# Altium project Teknofest_2022.PrjPcb
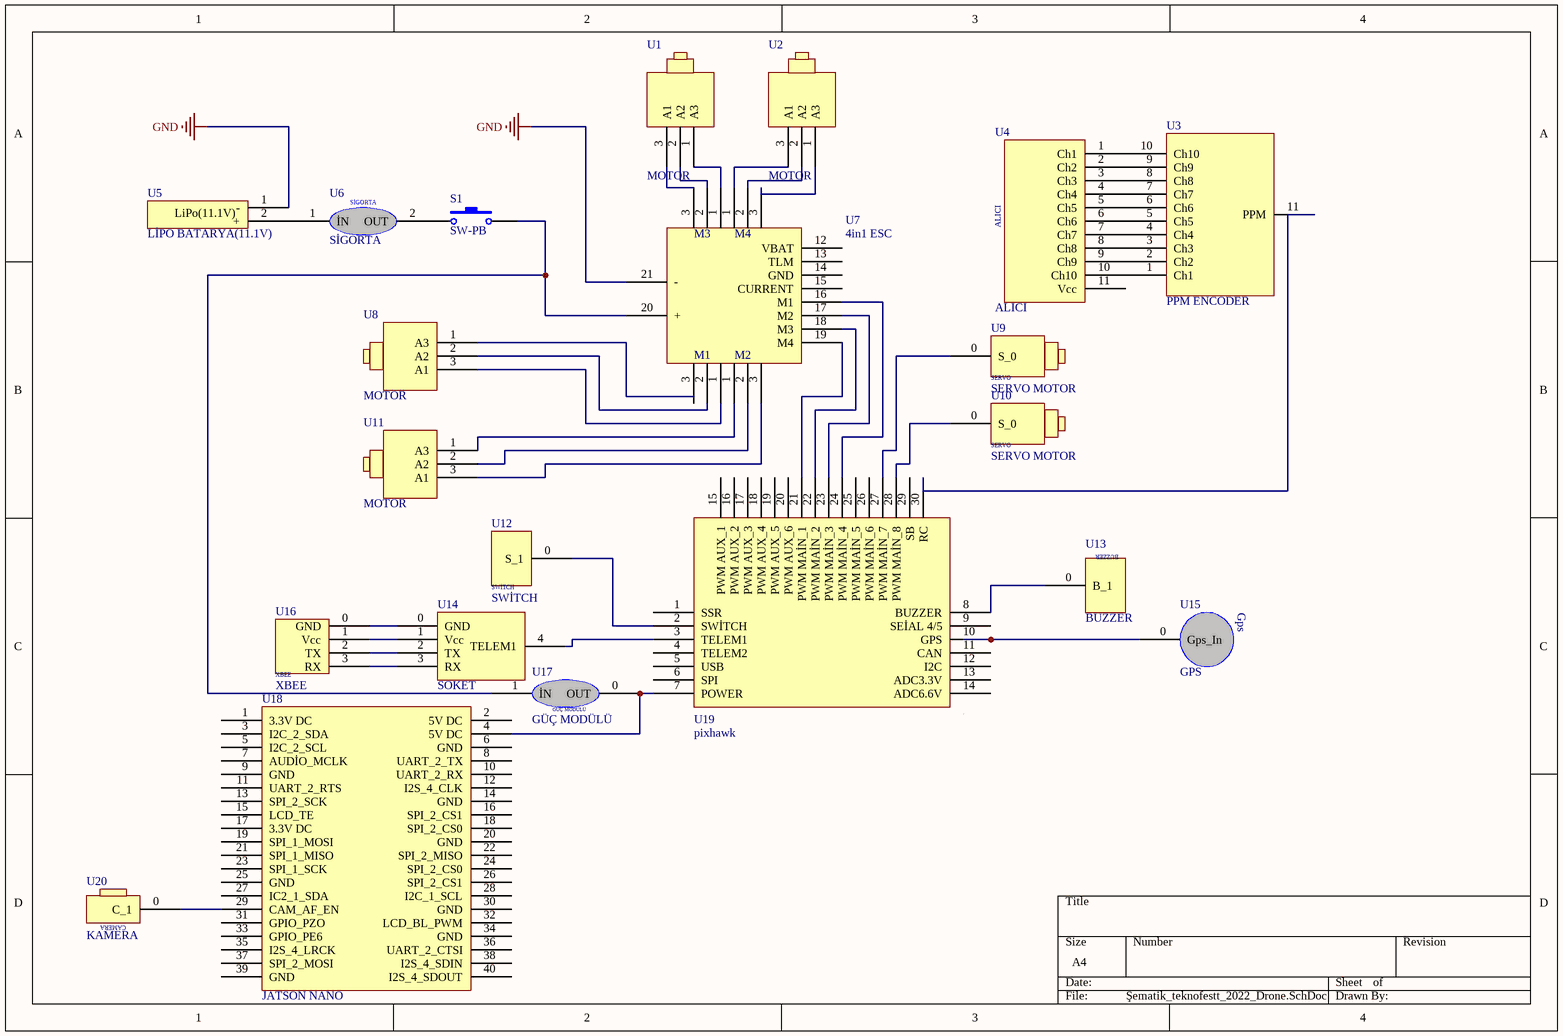
[diagram p0: Şematik_teknofestt_2022_Drone.SchDoc]
3 sheets, 43 parts. Net scope: flat (ports and power ports of the same name join across sheets).
Sheets:
  Şematik_teknofestt_2022_Drone.SchDoc
  Sheet1.SchDoc
  Sheet2.SchDoc

## Sheet Şematik_teknofestt_2022_Drone.SchDoc
size A4; SheetNumber: 1; SheetTotal: 2

### Parts
S1  SW-PB  [SPST-2]
U1  MOTOR
U2  MOTOR
U3  PPM ENCODER
U4  ALICI
U5  LİPO BATARYA(11.1V)
U6  SİGORTA
U7  4in1 ESC
U8  MOTOR
U9  SERVO MOTOR
U10  SERVO MOTOR
U11  MOTOR
U12  SWİTCH
U13  BUZZER
U14  SOKET
U15  GPS
U16  XBEE
U17  GÜÇ MODÜLÜ
U18  JATSON NANO
U19  pixhawk
U20  KAMERA

### Nets
GND: U5.1(-) U7.21(-)
NetS1_2: S1.2 U7.20(+) U17.1(İN)
NetU1_1: U1.1(A3) U7.1
NetU1_2: U1.2(A2) U7.2
NetU1_3: U1.3(A1) U7.3
NetU2_1: U2.1(A3) U7.3
NetU2_2: U2.2(A2) U7.2
NetU2_3: U2.3(A1) U7.1
NetU3_1: U3.1(Ch1) U4.10(Ch10)
NetU3_2: U3.2(Ch2) U4.9(Ch9)
NetU3_3: U3.3(Ch3) U4.8(Ch8)
NetU3_4: U3.4(Ch4) U4.7(Ch7)
NetU3_5: U3.5(Ch5) U4.6(Ch6)
NetU3_6: U3.6(Ch6) U4.5(Ch5)
NetU3_7: U3.7(Ch7) U4.4(Ch4)
NetU3_8: U3.8(Ch8) U4.3(Ch3)
NetU3_9: U3.9(Ch9) U4.2(Ch2)
NetU3_10: U3.10(Ch10) U4.1(Ch1)
NetU3_11: U3.11(PPM) U19.30(RC)
NetU5_2: U5.2(+) U6.1(İN)
NetU7_1: U7.1 U8.3(A1)
NetU7_1: U7.1 U11.1(A3)  [a separate net that carries the same name]
NetU7_2: U7.2 U8.2(A2)
NetU7_2: U7.2 U11.2(A2)  [a separate net that carries the same name]
NetU7_3: U7.3 U11.3(A1)
NetU7_16: U7.16(M1) U19.24(PWM_MAİN_4)
NetU7_17: U7.17(M2) U19.23(PWM_MAİN_3)
NetU7_18: U7.18(M3) U19.22(PWM_MAİN_2)
NetU7_19: U7.19(M4) U19.21(PWM_MAİN_1)
NetU9_0: U9.0(S_0) U19.27(PWM_MAİN_7)
NetU10_0: U10.0(S_0) U19.28(PWM_MAİN_8)
NetU12_0: U12.0(S_1) U19.2(SWİTCH)
NetU13_0: U13.0(B_1) U19.8(BUZZER)
NetU14_0: U14.0(GND) U16.0(GND)
NetU14_1: U14.1(Vcc) U16.1(Vcc)
NetU14_2: U14.2(TX) U16.2(TX)
NetU14_3: U14.3(RX) U16.3(RX)
NetU14_4: U14.4(TELEM1) U19.3(TELEM1)
NetU15_0: U15.0(Gps_In) U19.10(GPS)
NetU17_0: U17.0(OUT) U18.4(5V_DC) U19.7(POWER)
NetU18_29: U18.29(CAM_AF_EN) U20.0(C_1)

Not connected (* = marked no-connect by the designer): S1 1; U4 11(Vcc); U6 2(OUT); U7 12(VBAT) 13(TLM) 14(GND) 15(CURRENT); U8 1(A3); U18 1(3.3V_DC) 2(5V_DC) 3(I2C_2_SDA) 5(I2C_2_SCL) 6(GND) 7(AUDİO_MCLK) 8(UART_2_TX) 9(GND) 10(UART_2_RX) 11(UART_2_RTS) 12(I2S_4_CLK) 13(SPI_2_SCK) 14(GND) 15(LCD_TE) 16(SPI_2_CS1) 17(3.3V_DC) 18(SPI_2_CS0) 19(SPI_1_MOSI) 20(GND) 21(SPI_1_MISO) 22(SPI_2_MISO) 23(SPI_1_SCK) 24(SPI_2_CS0) 25(GND) 26(SPI_2_CS1) 27(IC2_1_SDA) 28(I2C_1_SCL) 30(GND) 31(GPIO_PZO) 32(LCD_BL_PWM) 33(GPIO_PE6) 34(GND) 35(I2S_4_LRCK) 36(UART_2_CTSI) 37(SPI_2_MOSI) 38(I2S_4_SDIN) 39(GND) 40(I2S_4_SDOUT); U19 1(SSR) 4(TELEM2) 5(USB) 6(SPI) 9(SEİAL_4/5) 11(CAN) 12(I2C) 13(ADC3.3V) 14(ADC6.6V) 15(PWM_AUX_1) 16(PWM_AUX_2) 17(PWM_AUX_3) 18(PWM_AUX_4) 19(PWM_AUX_5) 20(PWM_AUX_6) 25(PWM_MAİN_5) 26(PWM_MAİN_6) 29(SB)

### Notes on the sheet
- (in symbol GPS) Gps
- (in symbol KAMERA) CAMERA
- (in symbol LİPO BATARYA(11.1V)) LiPo(11.1V)
- (in symbol SERVO MOTOR) SERVO

### Library data of the parts
S1 = SW-PB: Switch; Published: 24-Mar-1999; LatestRevisionDate: 17-Jul-2002; LatestRevisionNote: Re-released for DXP Platform.; PackageReference: SPST-2; Publisher: Altium Limited; PackageDescription: Switch; 2 Leads

## Sheet Sheet1.SchDoc
size A4; SheetNumber: 2; SheetTotal: 2
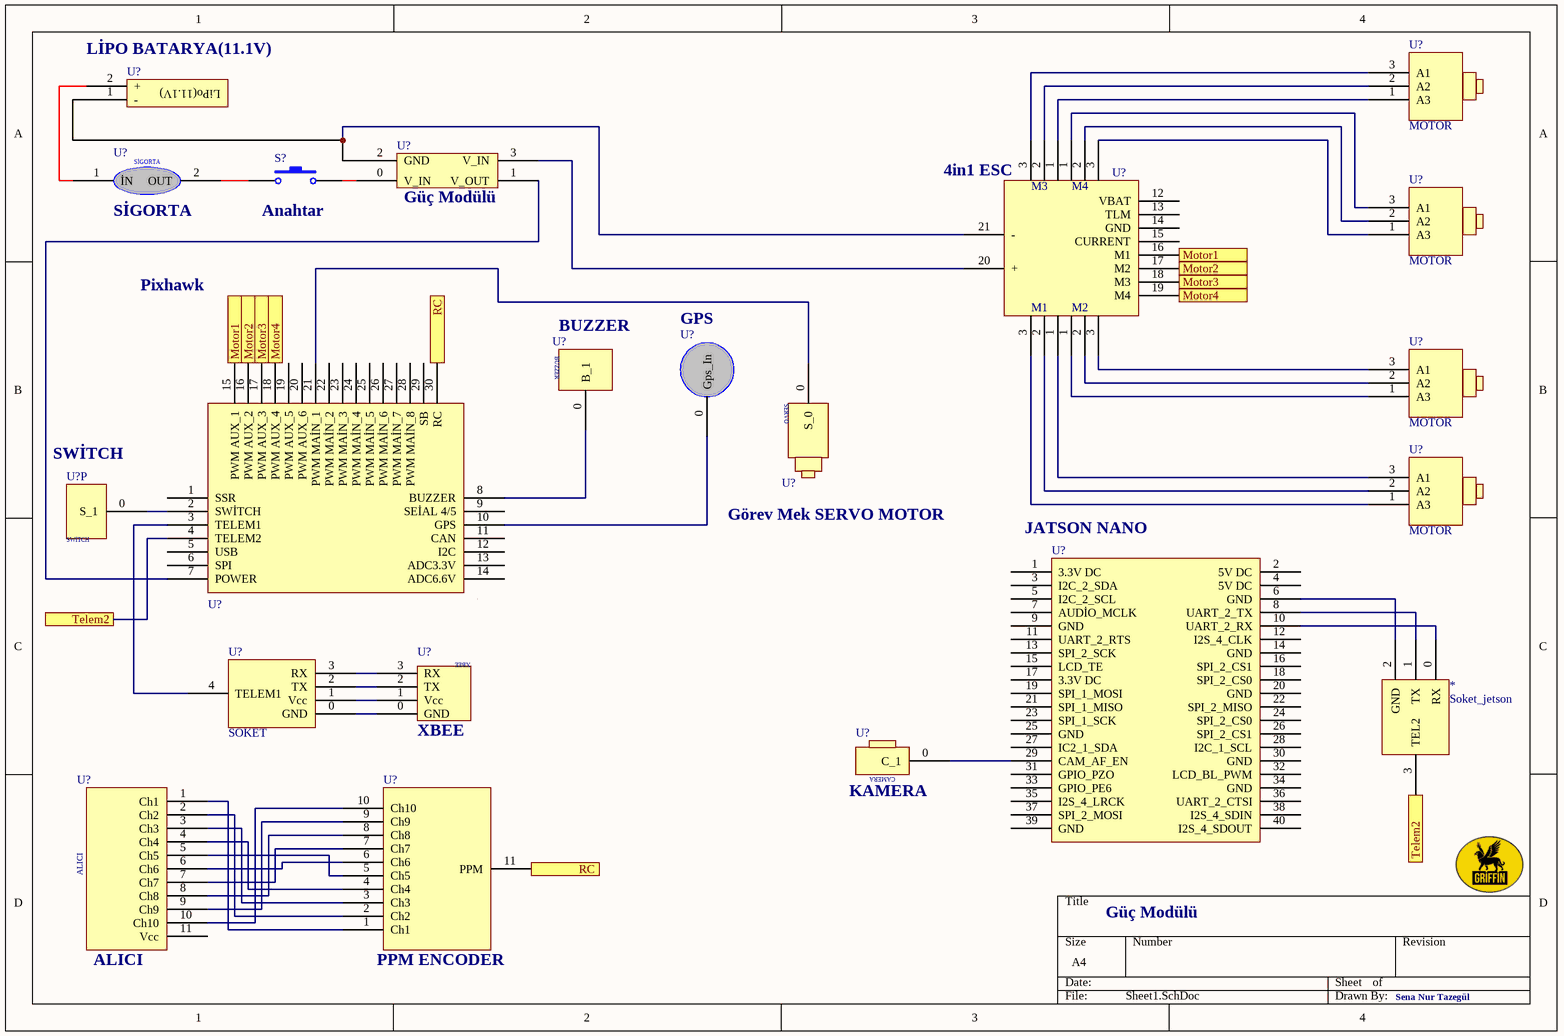
[diagram p1: Sheet1.SchDoc]

### Parts
(Parts that share a designator on the sheet are numbered #1, #2 ... from top to bottom, then left to right.)
*  Soket_jetson
S?  Anahtar  [SPST-2]
U?#1  Pixhawk
U?#2  LİPO BATARYA(11.1V)
U?#3  MOTOR
U?#4  (no value)
U?#5  SİGORTA
U?#6  4in1 ESC
U?#7  MOTOR
U?#8  BUZZER
U?#9  MOTOR
U?#10  GPS
U?#11  Görev Mek SERVO MOTOR
U?#12  MOTOR
U?#13  SOKET
U?#14  XBEE
U?#15  KAMERA
U?#16  ALICI
U?#17  JATSON NANO
U?#18  PPM ENCODER
U?P  SWİTCH

### Ports
Motor1, Motor2, Motor3, Motor4, RC, Telem2

### Nets
Net*_0: *.0(RX) U?#17.10(UART_2_RX)
Net*_1: *.1(TX) U?#17.8(UART_2_TX)
Net*_2: *.2(GND) U?#17.6(GND)
Net*_3: *.3(TEL2) U?#1.4(TELEM2) ; port Telem2
NetS?_1: S?.1 U?#5.2(OUT)
NetS?_2: S?.2 U?#4.0(V_IN)
NetU?#1_2: U?#1.2(SWİTCH) U?P.0(S_1)
NetU?#1_3: U?#1.3(TELEM1) U?#13.4(TELEM1)
NetU?#1_7: U?#1.7(POWER) U?#4.1(V_OUT)
NetU?#1_8: U?#1.8(BUZZER) U?#8.0(B_1)
NetU?#1_10: U?#1.10(GPS) U?#10.0(Gps_In)
NetU?#1_15: U?#1.15(PWM_AUX_1) U?#6.16(M1) ; port Motor1
NetU?#1_16: U?#1.16(PWM_AUX_2) U?#6.17(M2) ; port Motor2
NetU?#1_17: U?#1.17(PWM_AUX_3) U?#6.18(M3) ; port Motor3
NetU?#1_18: U?#1.18(PWM_AUX_4) U?#6.19(M4) ; port Motor4
NetU?#1_21: U?#1.21(PWM_MAİN_1) U?#11.0(S_0)
NetU?#1_30: U?#1.30(RC) U?#18.11(PPM) ; port RC
NetU?#2_1: U?#2.1(-) U?#4.2(GND) U?#6.21(-)
NetU?#2_2: U?#2.2(+) U?#5.1(İN)
NetU?#3_1: U?#3.1(A3) U?#6.1
NetU?#3_2: U?#3.2(A2) U?#6.2
NetU?#3_3: U?#3.3(A1) U?#6.3
NetU?#4_3: U?#4.3(V_IN) U?#6.20(+)
NetU?#6_1: U?#6.1 U?#9.1(A3)
NetU?#6_1: U?#6.1 U?#12.3(A1)  [a separate net that carries the same name]
NetU?#6_1: U?#6.1 U?#7.3(A1)  [a separate net that carries the same name]
NetU?#6_2: U?#6.2 U?#9.2(A2)
NetU?#6_2: U?#6.2 U?#12.2(A2)  [a separate net that carries the same name]
NetU?#6_2: U?#6.2 U?#7.2(A2)  [a separate net that carries the same name]
NetU?#6_3: U?#6.3 U?#9.3(A1)
NetU?#6_3: U?#6.3 U?#12.1(A3)  [a separate net that carries the same name]
NetU?#6_3: U?#6.3 U?#7.1(A3)  [a separate net that carries the same name]
NetU?#13_0: U?#13.0(GND) U?#14.0(GND)
NetU?#13_1: U?#13.1(Vcc) U?#14.1(Vcc)
NetU?#13_2: U?#13.2(TX) U?#14.2(TX)
NetU?#13_3: U?#13.3(RX) U?#14.3(RX)
NetU?#15_0: U?#15.0(C_1) U?#17.29(CAM_AF_EN)
NetU?#16_1: U?#16.1(Ch1) U?#18.1(Ch1)
NetU?#16_2: U?#16.2(Ch2) U?#18.2(Ch2)
NetU?#16_3: U?#16.3(Ch3) U?#18.3(Ch3)
NetU?#16_4: U?#16.4(Ch4) U?#18.4(Ch4)
NetU?#16_5: U?#16.5(Ch5) U?#18.5(Ch5)
NetU?#16_6: U?#16.6(Ch6) U?#18.6(Ch6)
NetU?#16_7: U?#16.7(Ch7) U?#18.7(Ch7)
NetU?#16_8: U?#16.8(Ch8) U?#18.8(Ch8)
NetU?#16_9: U?#16.9(Ch9) U?#18.9(Ch9)
NetU?#16_10: U?#16.10(Ch10) U?#18.10(Ch10)

Not connected (* = marked no-connect by the designer): U?#1 1(SSR) 5(USB) 6(SPI) 9(SEİAL_4/5) 11(CAN) 12(I2C) 13(ADC3.3V) 14(ADC6.6V) 19(PWM_AUX_5) 20(PWM_AUX_6) 22(PWM_MAİN_2) 23(PWM_MAİN_3) 24(PWM_MAİN_4) 25(PWM_MAİN_5) 26(PWM_MAİN_6) 27(PWM_MAİN_7) 28(PWM_MAİN_8) 29(SB); U?#6 12(VBAT) 13(TLM) 14(GND) 15(CURRENT); U?#16 11(Vcc); U?#17 1(3.3V_DC) 2(5V_DC) 3(I2C_2_SDA) 4(5V_DC) 5(I2C_2_SCL) 7(AUDİO_MCLK) 9(GND) 11(UART_2_RTS) 12(I2S_4_CLK) 13(SPI_2_SCK) 14(GND) 15(LCD_TE) 16(SPI_2_CS1) 17(3.3V_DC) 18(SPI_2_CS0) 19(SPI_1_MOSI) 20(GND) 21(SPI_1_MISO) 22(SPI_2_MISO) 23(SPI_1_SCK) 24(SPI_2_CS0) 25(GND) 26(SPI_2_CS1) 27(IC2_1_SDA) 28(I2C_1_SCL) 30(GND) 31(GPIO_PZO) 32(LCD_BL_PWM) 33(GPIO_PE6) 34(GND) 35(I2S_4_LRCK) 36(UART_2_CTSI) 37(SPI_2_MOSI) 38(I2S_4_SDIN) 39(GND) 40(I2S_4_SDOUT)

### Notes on the sheet
- Güç Modülü
- Sena Nur Tazegül
- (in symbol GÜÇ MODÜLÜ) Güç Modülü
- (in symbol KAMERA) CAMERA
- (in symbol LİPO BATARYA(11.1V)) LiPo(11.1V)
- (in symbol SERVO MOTOR) SERVO

### Library data of the parts
S? = SW-PB: Switch; Published: 24-Mar-1999; LatestRevisionDate: 17-Jul-2002; LatestRevisionNote: Re-released for DXP Platform.; PackageReference: SPST-2; Publisher: Altium Limited; PackageDescription: Switch; 2 Leads
U?#4 = GÜÇ MODÜLÜ
U?#11 = SERVO MOTOR

## Sheet Sheet2.SchDoc
size A4; SheetNumber: 3; SheetTotal: 3
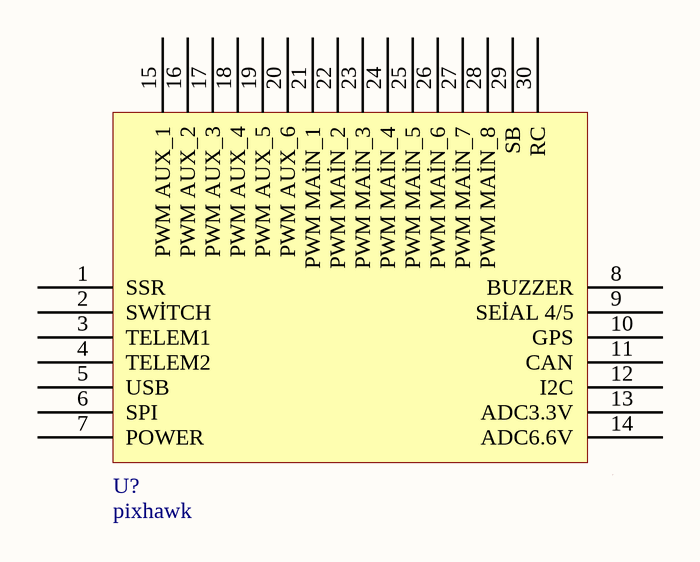
[diagram p2: Sheet2.SchDoc]

### Parts
(Parts that share a designator on the sheet are numbered #1, #2 ... from top to bottom, then left to right.)
U?#19  pixhawk

### Nets

Not connected (* = marked no-connect by the designer): U?#19 1(SSR) 2(SWİTCH) 3(TELEM1) 4(TELEM2) 5(USB) 6(SPI) 7(POWER) 8(BUZZER) 9(SEİAL_4/5) 10(GPS) 11(CAN) 12(I2C) 13(ADC3.3V) 14(ADC6.6V) 15(PWM_AUX_1) 16(PWM_AUX_2) 17(PWM_AUX_3) 18(PWM_AUX_4) 19(PWM_AUX_5) 20(PWM_AUX_6) 21(PWM_MAİN_1) 22(PWM_MAİN_2) 23(PWM_MAİN_3) 24(PWM_MAİN_4) 25(PWM_MAİN_5) 26(PWM_MAİN_6) 27(PWM_MAİN_7) 28(PWM_MAİN_8) 29(SB) 30(RC)